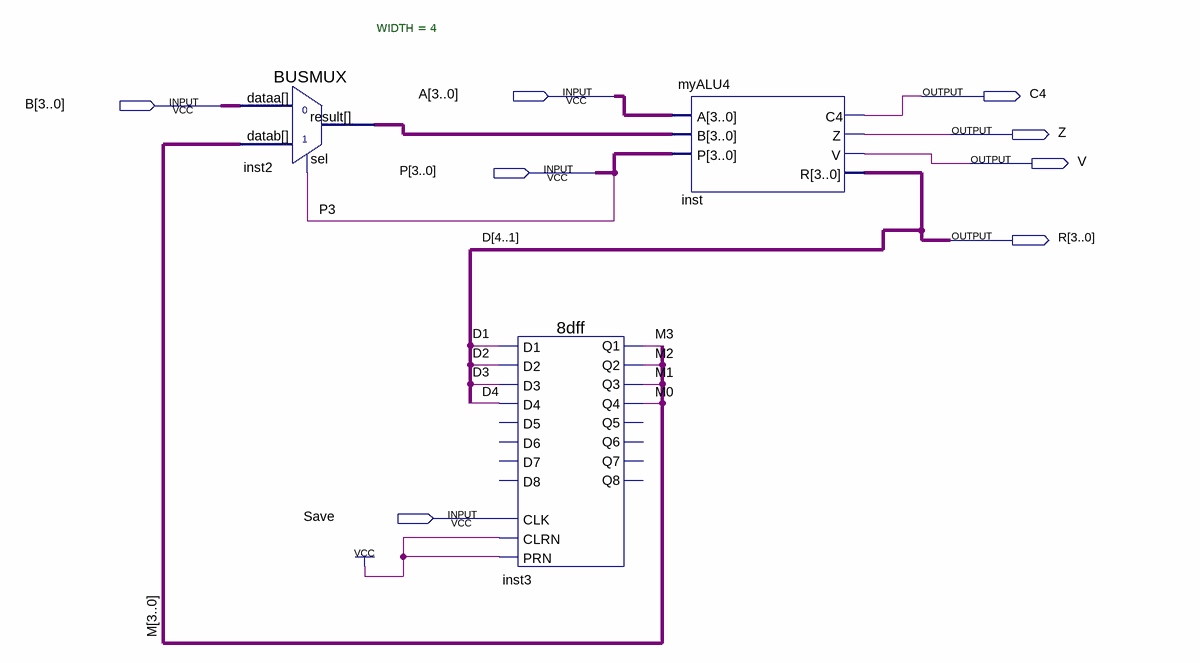
[diagram p0: schematic sheet]
// Quartus schematic Lab6.bdf as structural Verilog: 3 symbols, 8 pins
module Lab6 (
  input  [3:0] A,
  input  [3:0] B,
  input  [3:0] P,
  input  Save,
  output C4,
  output Z,
  output V,
  output [3:0] R
);

  wire [3:0] inst2_result, M;

  BUSMUX #(.WIDTH(4)) inst2 (.datab(M), .sel(P[3]), .dataa(B), .result(inst2_result));
  \8dff  inst3 (
    .D4(R[3]), .D3(R[2]), .PRN(1'b1), .CLK(Save), .CLRN(1'b1), .D2(R[1]), .D1(R[0]), .Q1(M[3]), .Q4(M[0]),
    .Q3(M[1]), .Q2(M[2]));  // open: D5, D8, D7, D6, Q8, Q5, Q6, Q7
  myALU4 inst (.A(A), .B(inst2_result), .P(P), .C4(C4), .Z(Z), .V(V), .R(R));

  // Other names for the same wires on the sheet: D[4:1] = R; D1 = R[0]; D2 = R[1]; D3 = R[2]; D4 = R[3]
endmodule
